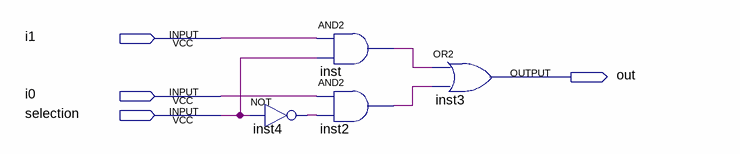
[diagram p0: schematic sheet]
// Quartus schematic 1bit_multiplexer.bdf as structural Verilog: 4 symbols, 4 pins
module \1bit_multiplexer  (
  input  i1,
  input  i0,
  input  selection,
  output out
);

  wire inst2_out, inst4_out, inst_out;

  not inst4 (inst4_out, selection);
  and inst (inst_out, i1, selection);
  and inst2 (inst2_out, i0, inst4_out);
  or inst3 (out, inst_out, inst2_out);
endmodule
